# EAGLE design Puzzle_Controller (EAGLE 9.6.2)
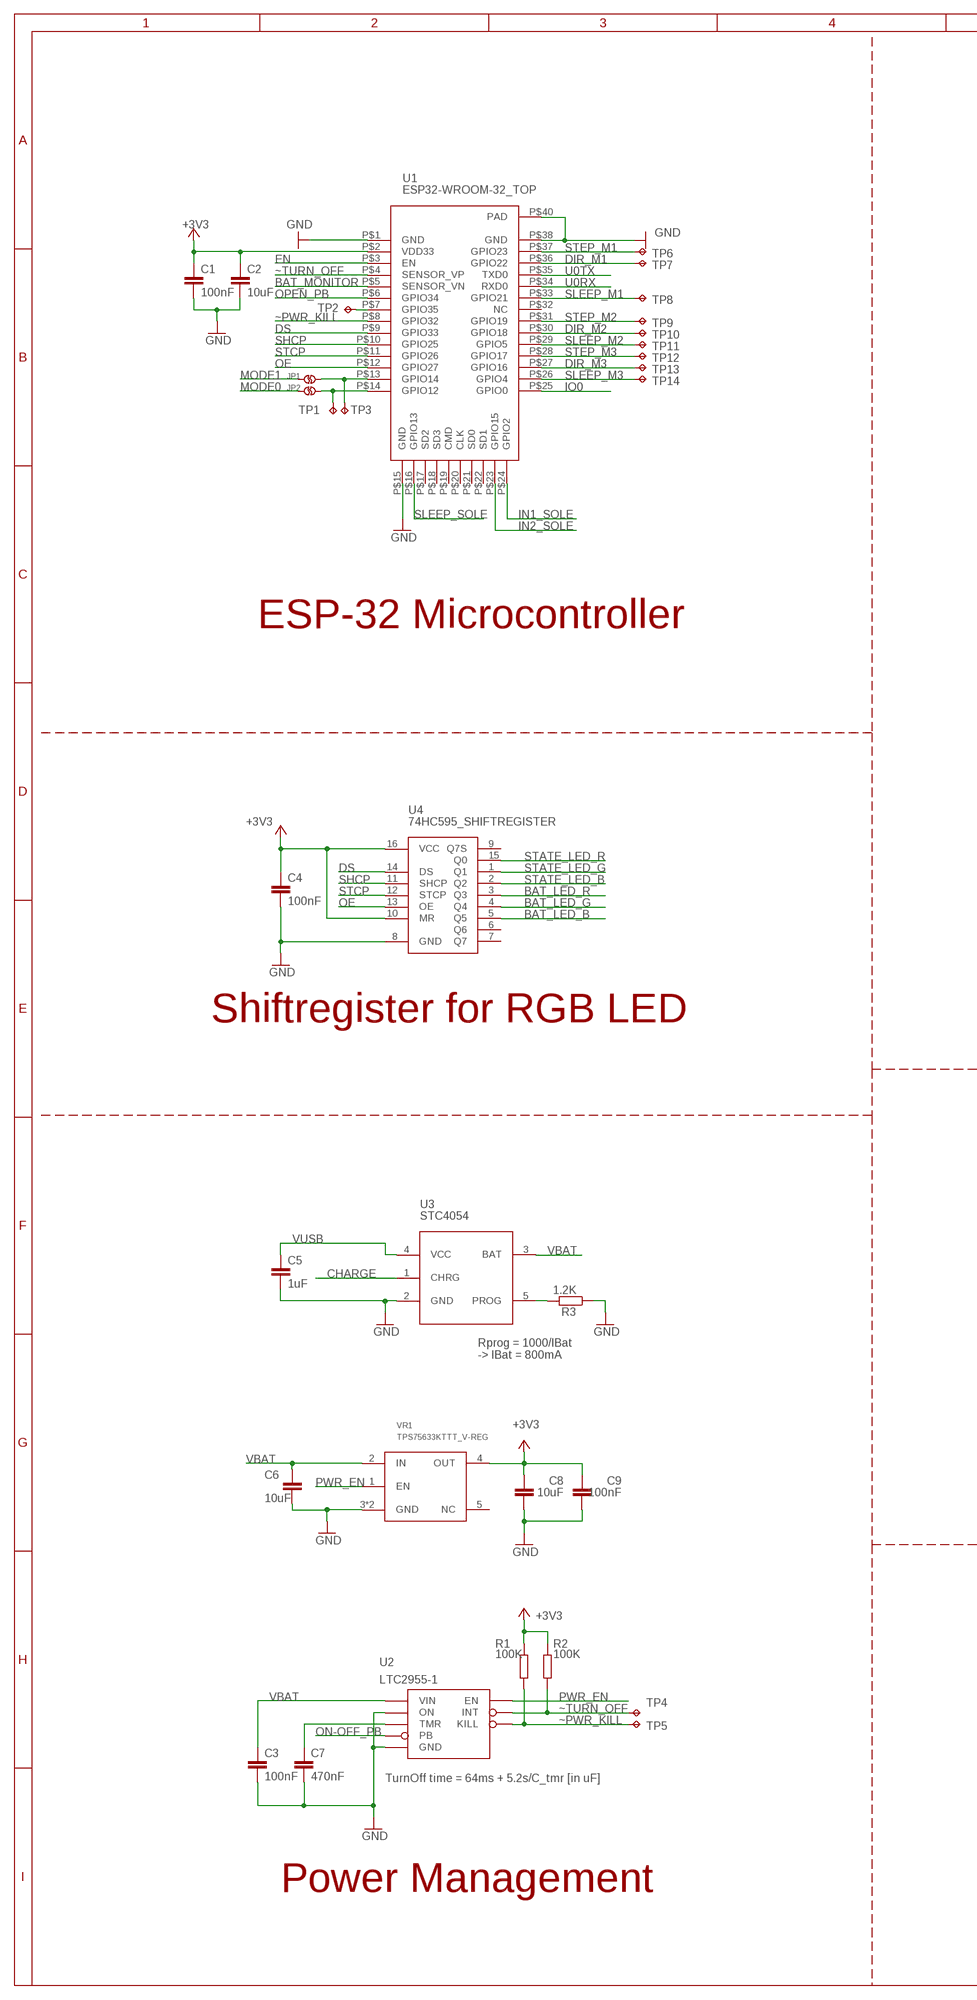
[diagram p0: schematic, sheet 1, part 1 of 2]
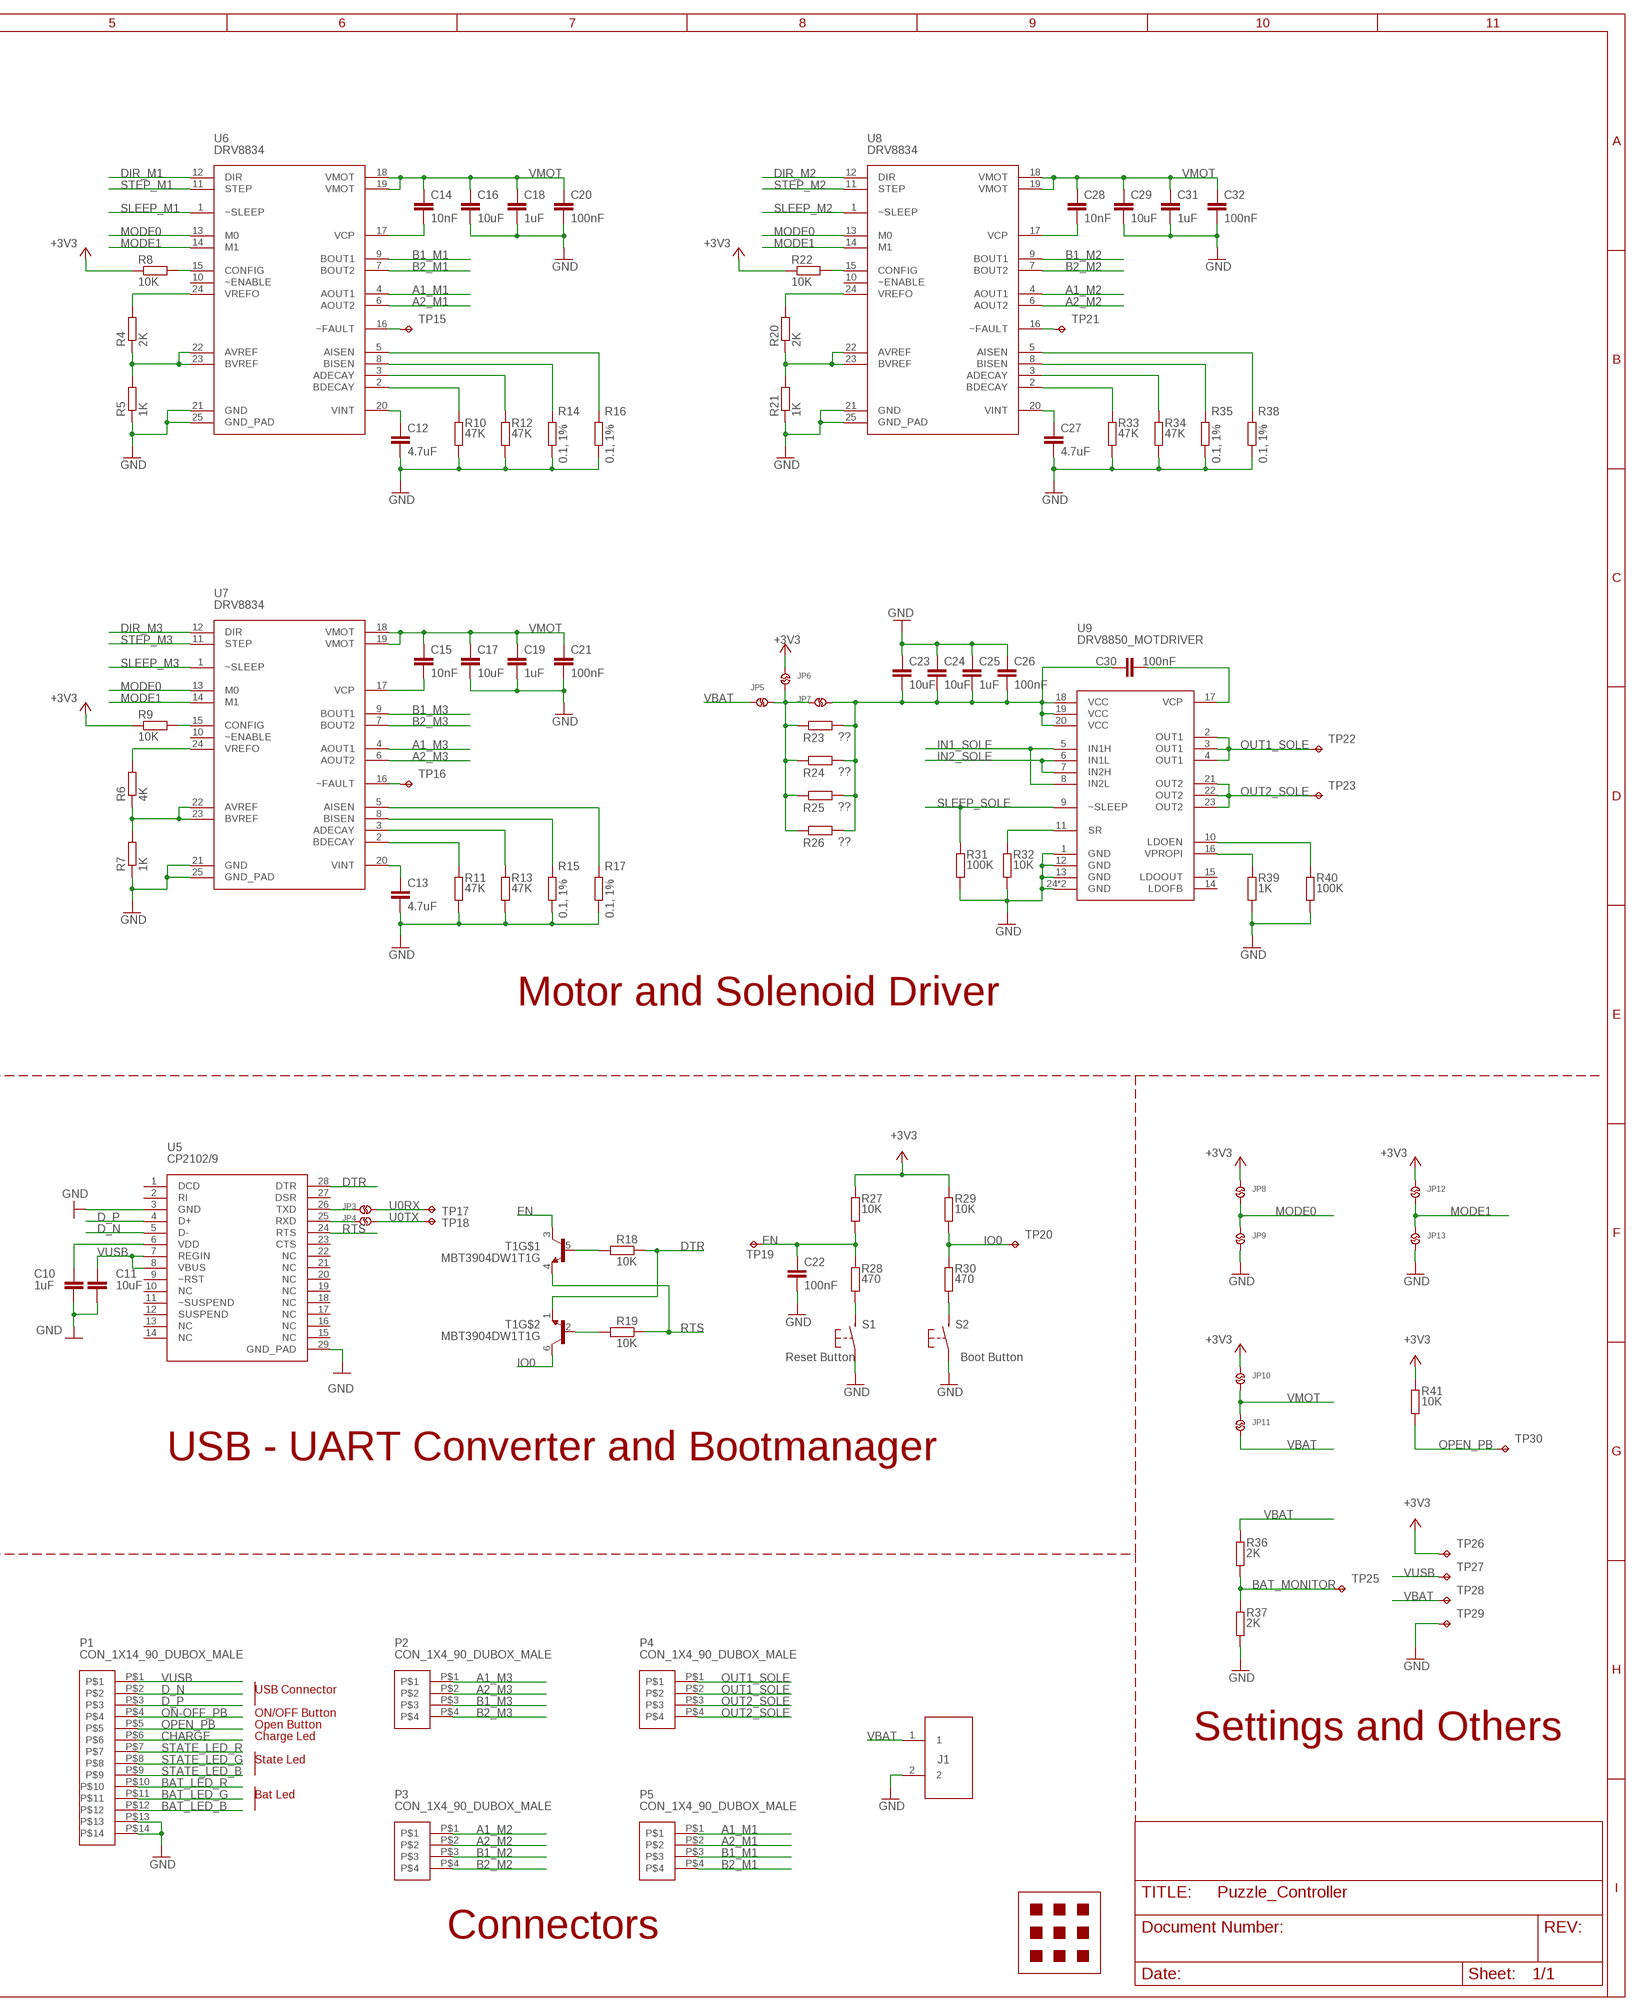
[diagram p1: schematic, sheet 1, part 2 of 2]

## Parts
C1  100nF  CAP_0603  [0603]
C2  10uF  CAP_0603  [0603]
C3  100nF  CAP_0603  [0603]
C4  100nF  CAP_0603  [0603]
C5  1uF  CAP_0603  [0603]
C6  10uF  CAP_0603  [0603]
C7  470nF  CAP_0603  [0603]
C8  10uF  CAP_0603  [0603]
C9  100nF  CAP_0603  [0603]
C10  1uF  CAP_0603  [0603]
C11  10uF  CAP_0603  [0603]
C12  4.7uF  CAP_0603  [0603]
C13  4.7uF  CAP_0603  [0603]
C14  10nF  CAP_0603  [0603]
C15  10nF  CAP_0603  [0603]
C16  10uF  CAP_0603  [0603]
C17  10uF  CAP_0603  [0603]
C18  1uF  CAP_0603  [0603]
C19  1uF  CAP_0603  [0603]
C20  100nF  CAP_0603  [0603]
C21  100nF  CAP_0603  [0603]
C22  100nF  CAP_0603  [0603]
C23  10uF  CAP_0603  [0603]
C24  10uF  CAP_0603  [0603]
C25  1uF  CAP_0603  [0603]
C26  100nF  CAP_0603  [0603]
C27  4.7uF  CAP_0603  [0603]
C28  10nF  CAP_0603  [0603]
C29  10uF  CAP_0603  [0603]
C30  100nF  CAP_0603  [0603]
C31  1uF  CAP_0603  [0603]
C32  100nF  CAP_0603  [0603]
J1  CON_2  [CON_2]
JP1  SOLDER_JUMPER  [SOLDER_JUMPER]
JP2  SOLDER_JUMPER  [SOLDER_JUMPER]
JP3  SOLDER_JUMPER  [SOLDER_JUMPER]
JP4  SOLDER_JUMPER  [SOLDER_JUMPER]
JP5  SOLDER_JUMPER  [SOLDER_JUMPER]
JP6  SOLDER_JUMPER  [SOLDER_JUMPER]
JP7  SOLDER_JUMPER  [SOLDER_JUMPER]
JP8  SOLDER_JUMPER  [SOLDER_JUMPER]
JP9  SOLDER_JUMPER  [SOLDER_JUMPER]
JP10  SOLDER_JUMPER  [SOLDER_JUMPER]
JP11  SOLDER_JUMPER  [SOLDER_JUMPER]
JP12  SOLDER_JUMPER  [SOLDER_JUMPER]
JP13  SOLDER_JUMPER  [SOLDER_JUMPER]
MEC1  FREESTYLE_PAD  [FREESTYLE_PAD]
P1  CON_1X14_90_DUBOX_MALE  [CON_1X14_90_DUBOX_MALE]
P2  CON_1X4_90_DUBOX_MALE  [CON_1X4_90_DUBOX_MALE]
P3  CON_1X4_90_DUBOX_MALE  [CON_1X4_90_DUBOX_MALE]
P4  CON_1X4_90_DUBOX_MALE  [CON_1X4_90_DUBOX_MALE]
P5  CON_1X4_90_DUBOX_MALE  [CON_1X4_90_DUBOX_MALE]
R1  100K  RES_0603  [0603]
R2  100K  RES_0603  [0603]
R3  1.2K  RES_0603  [0603]
R4  2K  RES_0603  [0603]
R5  1K  RES_0603  [0603]
R6  4K  RES_0603  [0603]
R7  1K  RES_0603  [0603]
R8  10K  RES_0603  [0603]
R9  10K  RES_0603  [0603]
R10  47K  RES_0603  [0603]
R11  47K  RES_0603  [0603]
R12  47K  RES_0603  [0603]
R13  47K  RES_0603  [0603]
R14  0.1, 1%  RES_0603  [0603]
R15  0.1, 1%  RES_0603  [0603]
R16  0.1, 1%  RES_0603  [0603]
R17  0.1, 1%  RES_0603  [0603]
R18  10K  RES_0603  [0603]
R19  10K  RES_0603  [0603]
R20  2K  RES_0603  [0603]
R21  1K  RES_0603  [0603]
R22  10K  RES_0603  [0603]
R23  ??  RES_0603  [0603]
R24  ??  RES_0603  [0603]
R25  ??  RES_0603  [0603]
R26  ??  RES_0603  [0603]
R27  10K  RES_0603  [0603]
R28  470  RES_0603  [0603]
R29  10K  RES_0603  [0603]
R30  470  RES_0603  [0603]
R31  100K  RES_0603  [0603]
R32  10K  RES_0603  [0603]
R33  47K  RES_0603  [0603]
R34  47K  RES_0603  [0603]
R35  0.1, 1%  RES_0603  [0603]
R36  2K  RES_0603  [0603]
R37  2K  RES_0603  [0603]
R38  0.1, 1%  RES_0603  [0603]
R39  1K  RES_0603  [0603]
R40  100K  RES_0603  [0603]
R41  10K  RES_0603  [0603]
S1  B3U-1000P  BUTTON_B3U-1000P  [B3U-1000P]
S2  B3U-1000P  BUTTON_B3U-1000P  [B3U-1000P]
T1  MBT3904DW1T1G  [SOT23-6]
TP1  TP  [TEST_PAD]
TP2  TP  [TEST_PAD]
TP3  TP  [TEST_PAD]
TP4  TP  [TEST_PAD]
TP5  TP  [TEST_PAD]
TP6  TP  [TEST_PAD]
TP7  TP  [TEST_PAD]
TP8  TP  [TEST_PAD]
TP9  TP  [TEST_PAD]
TP10  TP  [TEST_PAD]
TP11  TP  [TEST_PAD]
TP12  TP  [TEST_PAD]
TP13  TP  [TEST_PAD]
TP14  TP  [TEST_PAD]
TP15  TP  [TEST_PAD]
TP16  TP  [TEST_PAD]
TP17  TP  [TEST_PAD]
TP18  TP  [TEST_PAD]
TP19  TP  [TEST_PAD]
TP20  TP  [TEST_PAD]
TP21  TP  [TEST_PAD]
TP22  TP  [TEST_PAD]
TP23  TP  [TEST_PAD]
TP25  TP  [TEST_PAD]
TP26  TP  [TEST_PAD]
TP27  TP  [TEST_PAD]
TP28  TP  [TEST_PAD]
TP29  TP  [TEST_PAD]
TP30  TP  [TEST_PAD]
U1  ESP32-WROOM-32_TOP  [ESP32-WROOM-32_TOP]
U2  LTC2955-1  LTC2955-1_ON/OFF_CTLR  [SOT23-8]
U3  STC4054  STC4054_BAT_CHARGER  [TSOT23-5L]
U4  74HC595_SHIFTREGISTER  [SOIC-16]
U5  CP2102/9  [QFN-28]
U6  DRV8834  [TSSOP-24]
U7  DRV8834  [TSSOP-24]
U8  DRV8834  [TSSOP-24]
U9  DRV8850_MOTDRIVER  [QFN-24]
VR1  TPS75633KTTT_V-REG  [TPS75633KTTT_V-REG]

## Nets
+3V3: C1.1 C2.1 C4.1 C8.2 C9.2 JP6.P$2 JP8.P$1 JP10.P$1 JP12.P$1 R1.1 R2.1 R8.1 R9.1 R22.1 R27.2 R29.2 R41.2 TP26.TP U1.P$2(VDD33) U4.10(MR) U4.16(VCC) VR1.4(OUT)
A1_M1: P5.P$1 U6.4(AOUT1)
A1_M2: P3.P$1 U8.4(AOUT1)
A1_M3: P2.P$1 U7.4(AOUT1)
A2_M1: P5.P$2 U6.6(AOUT2)
A2_M2: P3.P$2 U8.6(AOUT2)
A2_M3: P2.P$2 U7.6(AOUT2)
B1_M1: P5.P$3 U6.9(BOUT1)
B1_M2: P3.P$3 U8.9(BOUT1)
B1_M3: P2.P$3 U7.9(BOUT1)
B2_M1: P5.P$4 U6.7(BOUT2)
B2_M2: P3.P$4 U8.7(BOUT2)
B2_M3: P2.P$4 U7.7(BOUT2)
BAT_LED_B: P1.P$12 U4.5(Q5)
BAT_LED_G: P1.P$11 U4.4(Q4)
BAT_LED_R: P1.P$10 U4.3(Q3)
BAT_MONITOR: R36.2 R37.1 TP25.TP U1.P$5(SENSOR_VN)
CHARGE: P1.P$6 U3.1(CHRG)
D_N: P1.P$2 U5.5(D-)
D_P: P1.P$3 U5.4(D+)
DIR_M1: TP7.TP U1.P$36(GPIO22) U6.12(DIR)
DIR_M2: TP10.TP U1.P$30(GPIO18) U8.12(DIR)
DIR_M3: TP13.TP U1.P$27(GPIO16) U7.12(DIR)
DS: U1.P$9(GPIO33) U4.14(DS)
DTR: R18.1 T1.1(E) U5.28(DTR)
EN: C22.1 R27.1 R28.2 T1.3(C) TP19.TP U1.P$3(EN)
GND: C1.2 C2.2 C3.2 C4.2 C5.2 C6.2 C7.2 C8.1 C9.1 C10.2 C11.2 C12.2 C13.2 C16.2 C17.2 C18.2 C19.2 C20.2 C21.2 C22.2 C23.1 C24.1 C25.1 C26.1 C27.2 C29.2 C31.2 C32.2 J1.2 JP9.P$2 JP13.P$2 P1.P$13 P1.P$14 R3.1 R5.1 R7.1 R10.1 R11.1 R12.1 R13.1 R14.1 R15.1 R16.1 R17.1 R21.1 R31.1 R32.1 R33.1 R34.1 R35.1 R37.2 R38.1 R39.1 R40.1 S1.P$1(P) S2.P$1(P) TP29.TP U1.P$1(GND) U1.P$15(GND) U1.P$38(GND) U1.P$40(PAD) U2.1(ON) U2.4(GND) U3.2(GND) U4.8(GND) U5.3(GND) U5.29(GND_PAD) U6.21(GND) U6.25(GND_PAD) U7.21(GND) U7.25(GND_PAD) U8.21(GND) U8.25(GND_PAD) U9.1(GND) U9.12(GND) U9.13(GND) U9.24(GND) U9.25(GND) VR1.3(GND) VR1.6(GND)
IN1_SOLE: U1.P$24(GPIO2) U9.5(IN1H) U9.8(IN2L)
IN2_SOLE: U1.P$23(GPIO15) U9.6(IN1L) U9.7(IN2H)
IO0: R29.1 R30.2 T1.6(C) TP20.TP U1.P$25(GPIO0)
MODE0: JP2.P$1 JP8.P$2 JP9.P$1 U6.13(M0) U7.13(M0) U8.13(M0)
MODE1: JP1.P$1 JP12.P$2 JP13.P$1 U6.14(M1) U7.14(M1) U8.14(M1)
N$1: R28.1 S1.P$2(S)
N$2: R8.2 U6.15(CONFIG)
N$3: R30.1 S2.P$2(S)
N$4: R18.2 T1.5(B)
N$5: R19.2 T1.2(B)
N$6: C10.1 U5.6(VDD)
N$7: R4.1 R5.2 U6.22(AVREF) U6.23(BVREF)
N$8: R4.2 U6.24(VREFO)
N$9: C14.2 U6.17(VCP)
N$10: C12.1 U6.20(VINT)
N$11: JP3.P$1 U5.26(TXD)
N$12: R10.2 U6.2(BDECAY)
N$13: R12.2 U6.3(ADECAY)
N$14: R14.2 U6.8(BISEN)
N$15: R16.2 U6.5(AISEN)
N$16: JP5.P$1 JP6.P$1 JP7.P$1 R23.1 R24.1 R25.1 R26.1
N$17: TP15.TP U6.16(~FAULT)
N$18: JP4.P$1 U5.25(RXD)
N$19: R3.2 U3.5(PROG)
N$20: TP2.TP U1.P$7(GPIO35)
N$21: R22.2 U8.15(CONFIG)
N$23: C23.2 C24.2 C25.2 C26.2 C30.1 JP7.P$2 R23.2 R24.2 R25.2 R26.2 U9.18(VCC) U9.19(VCC) U9.20(VCC)
N$24: JP1.P$2 TP3.TP U1.P$13(GPIO14)
N$25: C7.1 U2.3(TMR)
N$27: R20.1 R21.2 U8.22(AVREF) U8.23(BVREF)
N$28: R20.2 U8.24(VREFO)
N$29: C28.2 U8.17(VCP)
N$31: TP21.TP U8.16(~FAULT)
N$32: C27.1 U8.20(VINT)
N$33: R33.2 U8.2(BDECAY)
N$34: R34.2 U8.3(ADECAY)
N$35: R35.2 U8.8(BISEN)
N$37: R38.2 U8.5(AISEN)
N$38: R9.2 U7.15(CONFIG)
N$39: R6.1 R7.2 U7.22(AVREF) U7.23(BVREF)
N$40: R6.2 U7.24(VREFO)
N$41: C15.2 U7.17(VCP)
N$42: TP16.TP U7.16(~FAULT)
N$43: C13.1 U7.20(VINT)
N$44: R11.2 U7.2(BDECAY)
N$45: R13.2 U7.3(ADECAY)
N$46: R15.2 U7.8(BISEN)
N$47: R17.2 U7.5(AISEN)
N$48: R39.2 U9.16(VPROPI)
N$49: R32.2 U9.11(SR)
N$50: C30.2 U9.17(VCP)
N$52: R40.2 U9.10(LDOEN)
N$53: JP2.P$2 TP1.TP U1.P$14(GPIO12)
OE: U1.P$12(GPIO27) U4.13(OE)
ON-OFF_PB: P1.P$4 U2.5(PB)
OPEN_PB: P1.P$5 R41.1 TP30.TP U1.P$6(GPIO34)
OUT1_SOLE: P4.P$1 P4.P$2 TP22.TP U9.2(OUT1) U9.3(OUT1) U9.4(OUT1)
OUT2_SOLE: P4.P$3 P4.P$4 TP23.TP U9.21(OUT2) U9.22(OUT2) U9.23(OUT2)
PWR_EN: U2.7(EN) VR1.1(EN)
RTS: R19.1 T1.4(E) U5.24(RTS)
SHCP: U1.P$10(GPIO25) U4.11(SHCP)
SLEEP_M1: TP8.TP U1.P$33(GPIO21) U6.1(~SLEEP)
SLEEP_M2: TP11.TP U1.P$29(GPIO5) U8.1(~SLEEP)
SLEEP_M3: TP14.TP U1.P$26(GPIO4) U7.1(~SLEEP)
SLEEP_SOLE: R31.2 U1.P$16(GPIO13) U9.9(~SLEEP)
STATE_LED_B: P1.P$9 U4.2(Q2)
STATE_LED_G: P1.P$8 U4.1(Q1)
STATE_LED_R: P1.P$7 U4.15(Q0)
STCP: U1.P$11(GPIO26) U4.12(STCP)
STEP_M1: TP6.TP U1.P$37(GPIO23) U6.11(STEP)
STEP_M2: TP9.TP U1.P$31(GPIO19) U8.11(STEP)
STEP_M3: TP12.TP U1.P$28(GPIO17) U7.11(STEP)
U0RX: JP3.P$2 TP17.TP U1.P$34(RXD0)
U0TX: JP4.P$2 TP18.TP U1.P$35(TXD0)
VBAT: C3.1 C6.1 J1.1 JP5.P$2 JP11.P$2 R36.1 TP28.TP U2.6(VIN) U3.3(BAT) VR1.2(IN)
VMOT: C14.1 C15.1 C16.1 C17.1 C18.1 C19.1 C20.1 C21.1 C28.1 C29.1 C31.1 C32.1 JP10.P$2 JP11.P$1 U6.18(VMOT) U6.19(VMOT) U7.18(VMOT) U7.19(VMOT) U8.18(VMOT) U8.19(VMOT)
VUSB: C5.1 C11.1 P1.P$1 TP27.TP U3.4(VCC) U5.7(REGIN) U5.8(VBUS)
~PWR_KILL: R1.2 TP5.TP U1.P$8(GPIO32) U2.2(KILL)
~TURN_OFF: R2.2 TP4.TP U1.P$4(SENSOR_VP) U2.8(INT)
Unconnected: U1.P$17(SD2) U1.P$18(SD3) U1.P$19(CMD) U1.P$20(CLK) U1.P$21(SD0) U1.P$22(SD1) U1.P$32(NC) U4.6(Q6) U4.7(Q7) U4.9(Q7S) U5.1(DCD) U5.2(RI) U5.9(~RST) U5.10(NC) U5.11(~SUSPEND) U5.12(SUSPEND) U5.13(NC) U5.14(NC) U5.15(NC) U5.16(NC) U5.17(NC) U5.18(NC) U5.19(NC) U5.20(NC) U5.21(NC) U5.22(NC) U5.23(CTS) U5.27(DSR) U6.10(~ENABLE) U7.10(~ENABLE) U8.10(~ENABLE) U9.14(LDOFB) U9.15(LDOOUT) VR1.5(NC)

## Notes on the sheet
- ESP-32 Microcontroller
- Motor and Solenoid Driver
- Shiftregister for RGB LED
- Reset Button | Boot Button
- Rprog = 1000/IBat 
  -> IBat = 800mA
- USB - UART Converter and Bootmanager
- USB Connector
- ON/OFF Button
- Open Button
- Charge Led | Settings and Others
- State Led
- TurnOff time = 64ms + 5.2s/C_tmr [in uF]
- Bat Led
- Power Management
- Connectors

## Library data of the parts
C1-C32 = ZHAW_BA:CAP_0603: Cap, 0603, Keramik, X7R, +-10%
J1 = ZHAW_BA:CON_2: 2 Pin Solder Pad
JP1-JP13 = ZHAW_BA:SOLDER_JUMPER
MEC1 = ZHAW_BA:FREESTYLE_PAD: Pads 6x6 3mm Raster für spätere Änderungen
P1 = ZHAW_BA:CON_1X14_90_DUBOX_MALE: Dubox, 1x14Pin, 2.54 Raster DigiKey: Pt.Nr: 609-1290-ND https://www.digikey.ch/product-detail/de/amphenol-icc-fci/76382-314LF/609-1290-ND/1001604 NOTE: Gegenstück: 65240-014LF
P2-P5 = ZHAW_BA:CON_1X4_90_DUBOX_MALE: Dubox 1x4P, 90°, 2.54mm Raster Distrelec: Pt.Nr: Distrelec Bestellnummer LINK DigiKey: Pt.Nr: 609-1293-ND https://www.digikey.ch/product-detail/de/amphenol-icc-fci/76382-404LF/609-1293-ND/1001607 Gegenstück: 609-1264-ND
R1-R41 = ZHAW_BA:RES_0603: Resistor, 0603, 0.1 W, +-1%
S1 S2 = ZHAW_BA:BUTTON_B3U-1000P: SMD Button, 3 x 2.5 x 1.6 mm, 12V Distrelec: Pt.Nr: SW1020CT-ND https://www.digikey.ch/product-detail/de/omron-electronics-inc-emc-div/B3U-1000P/SW1020CT-ND/1534357 DigiKey: Pt.Nr: 135-59-010 https://www.distrelec.ch/de/subminiatur-tastschalter-b3u-schliesser-5n-5mm-omron-electronic-components-b3u-1000p/p/13559010?track=true&no-cache=true&marketingPopup=false
T1 = ZHAW_BA:MBT3904DW1T1G: Beschreibung Zweifacher NPN Transistor, 200mA, 40V DigiKey: Pt.Nr: MBT3904DW1T1GOSCT-ND https://www.digikey.ch/product-detail/de/on-semiconductor/MBT3904DW1T1G/MBT3904DW1T1GOSCT-ND/918012
TP1-TP23 TP25-TP30 = ZHAW_BA:TP
U1 = ZHAW_BA:ESP32-WROOM-32_TOP: ESP32 Mikrokontroller Distrelec: Pt.Nr: 301-29-219 https://www.distrelec.ch/de/esp32-wlan-bt-ble-mcu-modul-adafruit-3320/p/30129219?track=true&no-cache=true&marketingPopup=false DigiKey: Pt.Nr: 1528-1801-ND https://www.digikey.ch/product-detail/de/adafruit-industries-llc/3320/1528-1801-ND/6560941
U2 = ZHAW_BA:LTC2955-1_ON/OFF_CTLR: On/OFF Controller, PUSHBUTT TSOT23-8 DigiKey: Pt.Nr: LTC2955CTS8-1#TRMPBFCT-ND https://www.digikey.ch/products/de?keywords=LTC2955CTS8-1%23TRMPBFCT-ND
U3 = ZHAW_BA:STC4054_BAT_CHARGER: STC4054GR IC BATT CHG LI-ION 1CEL TSOT23-5, 800mA DigiKey: Pt.Nr: 497-5809-1-ND https://www.digikey.ch/product-detail/de/stmicroelectronics/STC4054GR/497-5809-1-ND/1506465
U4 = ZHAW_BA:74HC595_SHIFTREGISTER: Shiftregister 74HC595D-Q100,118, 8Bit DigiKey: Pt.Nr: 1727-1011-1-ND https://www.digikey.ch/product-detail/de/nexperia-usa-inc/74HC595D-Q100-118/1727-1011-1-ND/3749018
U5 = ZHAW_BA:CP2102/9: Schnittstellen - Controller, USB-TO-UART BRIDGE 28VQFN DigiKey: Pt.Nr: 336-1160-1-ND https://www.digikey.ch/products/de/integrated-circuits-ics/interface-controllers/753?k=CP2102&k=&pkeyword=CP2102&sv=0&pv7=2&sf=0&FV=-8%7C753&quantity=&ColumnSort=0&page=1&stock=1&pageSize=25
U6-U8 = ZHAW_BA:DRV8834: DRV8834, Steppermotordriver, 1/32 Step, 1.5A DigiKey: Pt.Nr: 296-30428-5-ND https://www.digikey.ch/products/de/integrated-circuits-ics/pmic-motor-drivers-controllers/744?k=drv8834&k=&pkeyword=drv8834&sv=0&pv7=1&pv7=2&pv7=6&sf=0&FV=-8%7C744&quantity=&ColumnSort=0&page=1&stock=1&pageSize=25
U9 = ZHAW_BA:DRV8850_MOTDRIVER: Motordriver, 2-5.5V, 5A 24QFN DigiKey: Pt.Nr: 296-DRV8850RGYTCT-ND https://www.digikey.ch/product-detail/de/texas-instruments/DRV8850RGYT/296-DRV8850RGYTCT-ND/10665656
VR1 = ZHAW_BA:TPS75633KTTT_V-REG: Voltage Regulator, Linear, 3.3Vm 5A, DDPAK-5 DigiKey: Pt.Nr: 296-15919-1-ND https://www.digikey.ch/product-detail/de/texas-instruments/TPS75633KTTT/296-15919-1-ND/606353

## Board
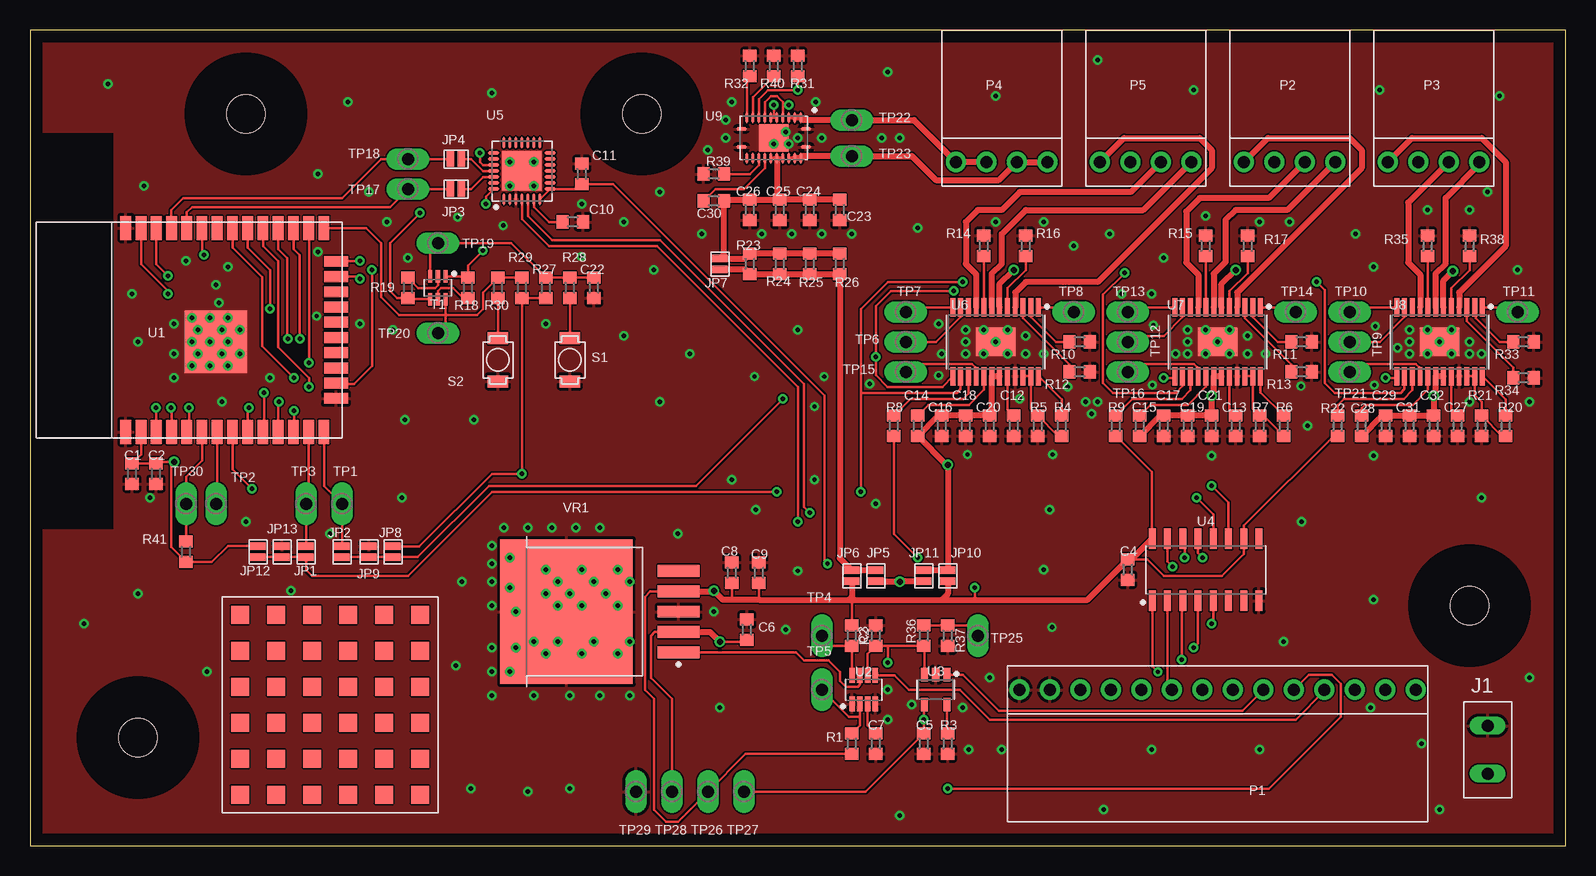
[diagram p2: board, top side]
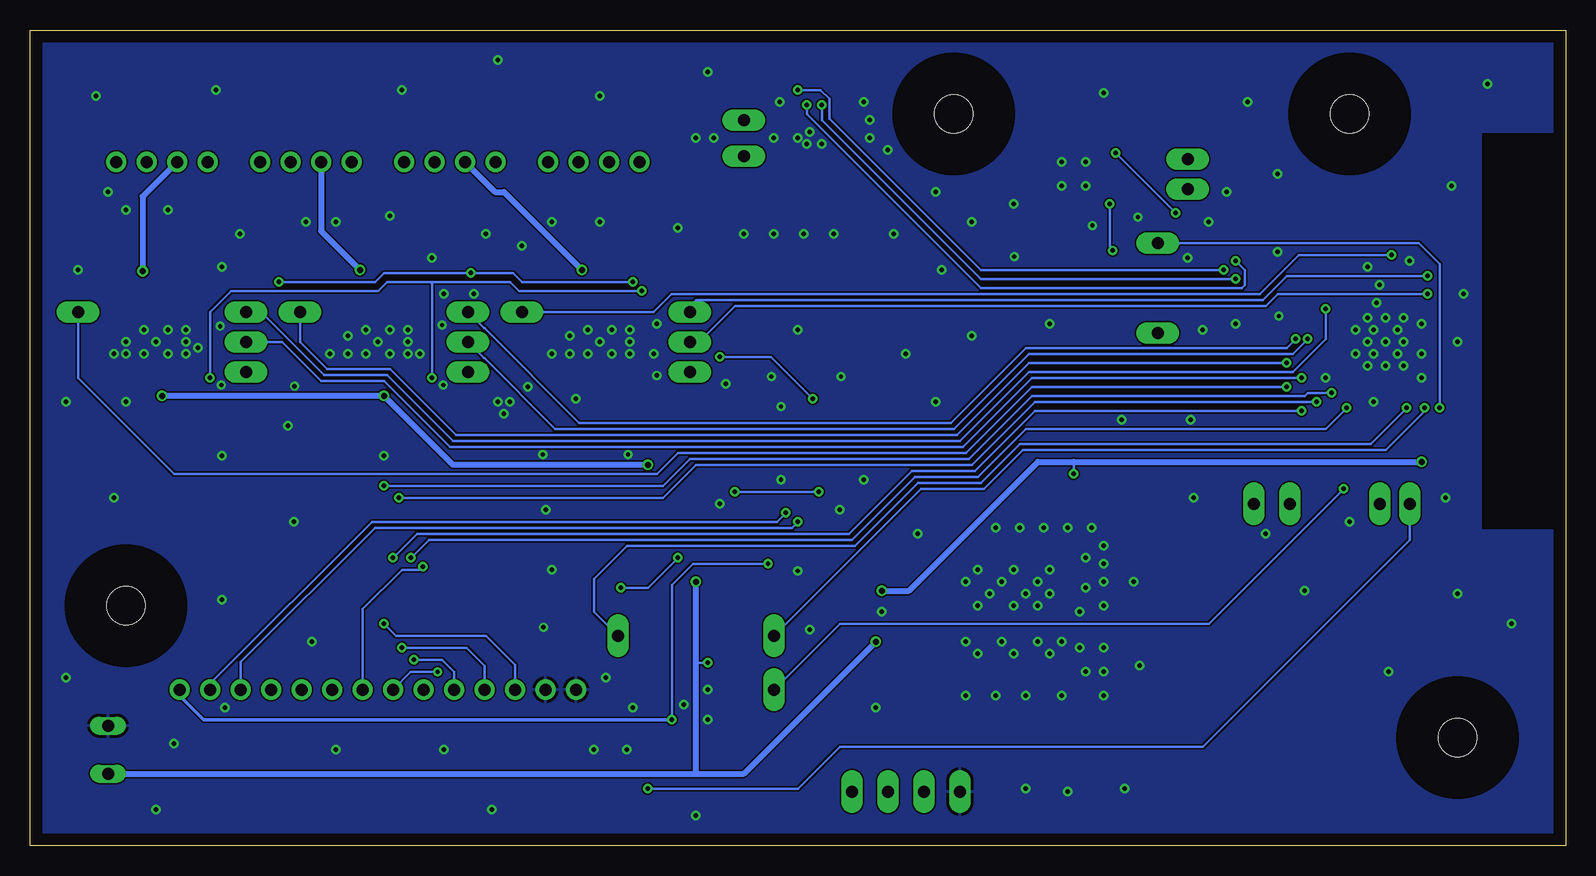
[diagram p3: board, bottom side, seen from below]

Size 128 x 68 mm. Coordinates in mm from the lower left corner, seen from the top.
Outline: 0,0 128,0 128,68 0,68 0,0
Copper layers (1*16): Top 0.035mm / dielectric 1.5mm / Bottom 0.035mm
Design rules "default *": minimum track width 6mil, minimum drill 0.35mm, track to track 5mil, track to pad 6mil, pad to pad 4mil, via to via 6mil, smd to smd 4mil, copper to edge 40mil, drill to drill 6mil, minimum pad ring 10mil, minimum via ring 8mil, stop-mask expansion 4mil, vias tented up to drill 20mil, thermal gap 10mil
Holes 3.2 mm at 9,9 18,61 120,20 51,61
tRestrict: area 115,15 to 125,25; area 4,4 to 14,14; area 13,56 to 23,66; area 46,56 to 56,66
bRestrict: area 13,56 to 23,66; area 46,56 to 56,66; area 115,15 to 125,25; area 4,4 to 14,14

### Footprints (pad centres in the part's own frame; a part is rotated, then mirrored left to right if it is on the bottom)
0603 = smd 1 x 1.1: 1 -0.85,0; 2 0.85,0
CON_2 = drill 1 long: 1 -2,0; 2 2,0
SOLDER_JUMPER = smd 0.635 x 1.27: P$1 -0.45,0; P$2 0.45,0
FREESTYLE_PAD = smd 1.5 x 1.5: P$1 1.5,1.5; P$2 4.5,1.5; P$3 7.5,1.5; P$4 10.5,1.5; P$5 13.5,1.5; P$6 1.5,4.5; P$7 4.5,4.5; P$8 7.5,4.5; P$9 10.5,4.5; P$10 13.5,4.5; P$11 1.5,7.5; P$12 4.5,7.5; P$13 7.5,7.5; P$14 10.5,7.5; P$15 13.5,7.5; P$16 1.5,10.5; P$17 4.5,10.5; P$18 7.5,10.5; P$19 10.5,10.5; P$20 13.5,10.5; P$21 1.5,13.5; P$22 4.5,13.5; P$23 7.5,13.5; P$24 10.5,13.5; P$25 13.5,13.5; P$26 16.5,1.5; P$27 16.5,4.5; P$28 16.5,7.5; P$29 16.5,10.5; P$30 16.5,13.5; P$31 16.5,16.5; P$32 13.5,16.5; P$33 10.5,16.5; P$34 7.5,16.5; P$35 4.5,16.5; P$36 1.5,16.5
CON_1X14_90_DUBOX_MALE = drill 1 pad 1.676: P$1 -16.51,0; P$2 -13.97,0; P$3 -11.43,0; P$4 -8.89,0; P$5 -6.35,0; P$6 -3.81,0; P$7 -1.27,0; P$8 1.27,0; P$9 3.81,0; P$10 6.35,0; P$11 8.89,0; P$12 11.43,0; P$13 13.97,0; P$14 16.51,0
CON_1X4_90_DUBOX_MALE = drill 1 pad 1.676: P$1 -3.81,0; P$2 -1.27,0; P$3 1.27,0; P$4 3.81,0
B3U-1000P = smd 1 x 1.7: P$1 -1.8,0; P$2 1.8,0
SOT23-6 = smd 1.02 x 0.36: 1 -0.955,0.65; 2 -0.955,0; 3 -0.955,-0.65; 4 0.955,-0.65; 5 0.955,0; 6 0.955,0.65
TEST_PAD = drill 1 pad 1.8 long: TP 0,0
ESP32-WROOM-32_TOP = smd 2 x 0.9: P$1 0.5,18.01; P$2 0.5,16.74; P$3 0.5,15.47; P$4 0.5,14.2; P$5 0.5,12.93; P$6 0.5,11.66; P$7 0.5,10.39; P$8 0.5,9.12; P$9 0.5,7.85; P$10 0.5,6.58; P$11 0.5,5.31; P$12 0.5,4.04; P$13 0.5,2.77; P$14 0.5,1.5; P$25 17.5,1.5; P$26 17.5,2.77; P$27 17.5,4.04; P$28 17.5,5.31; P$29 17.5,6.58; P$30 17.5,7.85; P$31 17.5,9.12; P$32 17.5,10.39; P$33 17.5,11.66; P$34 17.5,12.93; P$35 17.5,14.2; P$36 17.5,15.47; P$37 17.5,16.74; P$38 17.5,18.01 | smd 0.9 x 2: P$15 3.285,0.5; P$16 4.555,0.5; P$17 5.825,0.5; P$18 7.095,0.5; P$19 8.365,0.5; P$20 9.635,0.5; P$21 10.905,0.5; P$22 12.175,0.5; P$23 13.445,0.5; P$24 14.715,0.5 | smd 5.2 x 5.2: P$40 8,10.51
SOT23-8 = smd 1.237 x 0.459: 1 -1.187,0.975; 2 -1.187,0.325; 3 -1.187,-0.325; 4 -1.187,-0.975; 5 1.187,-0.975; 6 1.187,-0.325; 7 1.187,0.325; 8 1.187,0.975
TSOT23-5L = smd 1.119 x 0.589: 1 -1.246,0.95; 2 -1.246,0; 3 -1.246,-0.95; 4 1.246,-0.95; 5 1.246,0.95
SOIC-16 = smd 1.746 x 0.592: 1 -2.585,4.445; 2 -2.585,3.175; 3 -2.585,1.905; 4 -2.585,0.635; 5 -2.585,-0.635; 6 -2.585,-1.905; 7 -2.585,-3.175; 8 -2.585,-4.445; 9 2.585,-4.445; 10 2.585,-3.175; 11 2.585,-1.905; 12 2.585,-0.635; 13 2.585,0.635; 14 2.585,1.905; 15 2.585,3.175; 16 2.585,4.445
QFN-28 = smd 0.969 x 0.264: 1 -2.371,1.5; 2 -2.371,1; 3 -2.371,0.5; 4 -2.371,0; 5 -2.371,-0.5; 6 -2.371,-1; 7 -2.371,-1.5; 15 2.371,-1.5; 16 2.371,-1; 17 2.371,-0.5; 18 2.371,0; 19 2.371,0.5; 20 2.371,1; 21 2.371,1.5 | smd 0.264 x 0.969: 8 -1.5,-2.371; 9 -1,-2.371; 10 -0.5,-2.371; 11 0,-2.371; 12 0.5,-2.371; 13 1,-2.371; 14 1.5,-2.371; 22 1.5,2.371; 23 1,2.371; 24 0.5,2.371; 25 0,2.371; 26 -0.5,2.371; 27 -1,2.371; 28 -1.5,2.371 | smd 3.3 x 3.3: 29 0,0
TSSOP-24 = smd 1.572 x 0.407: 1 -2.872,3.575; 2 -2.872,2.925; 3 -2.872,2.275; 4 -2.872,1.625; 5 -2.872,0.975; 6 -2.872,0.325; 7 -2.872,-0.325; 8 -2.872,-0.975; 9 -2.872,-1.625; 10 -2.872,-2.275; 11 -2.872,-2.925; 12 -2.872,-3.575; 13 2.872,-3.575; 14 2.872,-2.925; 15 2.872,-2.275; 16 2.872,-1.625; 17 2.872,-0.975; 18 2.872,-0.325; 19 2.872,0.325; 20 2.872,0.975; 21 2.872,1.625; 22 2.872,2.275; 23 2.872,2.925; 24 2.872,3.575 | smd 2.4 x 3.3: 25 0,0
QFN-24 = smd 0.896 x 0.27: 1 -2.687,-0.75; 12 2.687,-0.75; 13 2.687,0.75; 24 -2.687,0.75 | smd 0.27 x 0.896: 2 -2.25,-1.687; 3 -1.75,-1.687; 4 -1.25,-1.687; 5 -0.75,-1.687; 6 -0.25,-1.687; 7 0.25,-1.687; 8 0.75,-1.687; 9 1.25,-1.687; 10 1.75,-1.687; 11 2.25,-1.687; 14 2.25,1.687; 15 1.75,1.687; 16 1.25,1.687; 17 0.75,1.687; 18 0.25,1.687; 19 -0.25,1.687; 20 -0.75,1.687; 21 -1.25,1.687; 22 -1.75,1.687; 23 -2.25,1.687 | smd 2.44 x 2.26: 25 0,0
TPS75633KTTT_V-REG = smd 3.469 x 0.994: 1 -6.558,3.4; 2 -6.558,1.7; 3 -6.558,0; 4 -6.558,-1.7; 5 -6.558,-3.4 | smd 11.025 x 12.066: 6 2.78,0

### Placement (x,y rotation side)
C1  8.5,31 270 top
C2  10.5,31 270 top
C3  70.5,17.5 90 top
C4  91.5,23 270 top
C5  74.5,8.5 270 top
C6  59.75,18 90 top
C7  70.5,8.5 270 top
C8  58.5,22.75 270 top
C9  60.75,22.75 270 top
C10  45.25,52 0 top
C11  46,56 90 top
C12  82,35 270 top
C13  100.5,35 270 top
C14  74,35 90 top
C15  92.5,35 90 top
C16  76,35 270 top
C17  94.5,35 270 top
C18  78,35 270 top
C19  96.5,35 270 top
C20  80,35 270 top
C21  98.5,35 270 top
C22  47,46.5 270 top
C23  67.5,53 90 top
C24  65,53 90 top
C25  62.5,53 90 top
C26  60,53 90 top
C27  119,35 270 top
C28  111,35 90 top
C29  113,35 270 top
C30  57,53.75 180 top
C31  115,35 270 top
C32  117,35 270 top
J1  121.5,8 90 top
JP1  23,24.5 90 top
JP2  26,24.5 90 top
JP3  35.5,54.75 180 top
JP4  35.5,57.25 180 top
JP5  70.5,22.5 270 top
JP6  68.5,22.5 270 top
JP7  57.5,48.5 90 top
JP8  30.25,24.5 270 top
JP9  28.25,24.5 90 top
JP10  76.5,22.5 90 top
JP11  74.5,22.5 270 top
JP12  19,24.5 270 top
JP13  21,24.5 90 top
MEC1  16,2.75 0 top
P1  99,13 180 top
P2  105,57 0 top
P3  117,57 0 top
P4  81,57 0 top
P5  93,57 0 top
R1  68.5,8.5 90 top
R2  68.5,17.5 270 top
R3  76.5,8.5 90 top
R4  86,35 90 top
R5  84,35 90 top
R6  104.5,35 90 top
R7  102.5,35 90 top
R8  72,35 90 top
R9  90.5,35 90 top
R10  87.5,42 180 top
R11  106,42 180 top
R12  87.5,39.5 180 top
R13  106,39.5 180 top
R14  79.5,50 270 top
R15  98,50 270 top
R16  83,50 270 top
R17  101.5,50 270 top
R18  36.5,46.5 270 top
R19  31.5,46.5 90 top
R20  123,35 90 top
R21  121,35 90 top
R22  109,35 90 top
R23  60,48.5 90 top
R24  62.5,48.5 90 top
R25  65,48.5 90 top
R26  67.5,48.5 90 top
R27  43,46.5 270 top
R28  45,46.5 90 top
R29  41,46.5 270 top
R30  39,46.5 90 top
R31  64,65 270 top
R32  60,65 270 top
R33  124.5,42 180 top
R34  124.5,39 180 top
R35  116.5,50 270 top
R36  74.5,17.5 90 top
R37  76.5,17.5 270 top
R38  120,50 270 top
R39  57,56 0 top
R40  62,65 270 top
R41  13,24.5 270 top
S1  45,40.5 90 top
S2  39,40.5 90 top
T1  34,46.5 270 top
TP1  26,28.5 0 top
TP2  15.5,28.5 0 top
TP3  23,28.5 0 top
TP4  66,17.5 0 top
TP5  66,13 0 top
TP6  73,42 270 top
TP7  73,44.5 270 top
TP8  87,44.5 90 top
TP9  110,42 270 top
TP10  110,44.5 270 top
TP11  124,44.5 270 top
TP12  91.5,42 270 top
TP13  91.5,44.5 270 top
TP14  105.5,44.5 270 top
TP15  73,39.5 90 top
TP16  91.5,39.5 270 top
TP17  31.5,54.75 90 top
TP18  31.5,57.25 90 top
TP19  34,50.25 90 top
TP20  34,42.75 90 top
TP21  110,39.5 270 top
TP22  68.5,60.5 90 top
TP23  68.5,57.5 90 top
TP25  79,17.5 180 top
TP26  56.5,4.5 180 top
TP27  59.5,4.5 180 top
TP28  53.5,4.5 180 top
TP29  50.5,4.5 180 top
TP30  13,28.5 0 top
U1  26,34 90 top
U2  69.5,13 90 top
U3  75.5,13 270 top
U4  98,23 90 top
U5  41,56.25 90 top
U6  80.5,42 270 top
U7  99,42 270 top
U8  117.5,42 270 top
U9  62,59 180 top
VR1  47.5,19.5 180 top

### Tracks (layer width: path | path; a pad name or v marks a point on that pad's centre or on a via)
+3V3  (via drill 0.35, 0.5)
  Top 0.2: U4.16 93.5,25.64 93.5,31.15 R9.1 | C4.1 93.15,23.85 94.5,22.5 99.35,22.5 101.17,24.33 U4.10 101.17,26.68 108.75,34.25 108.9,34.25 R22.1 | C8.2 58.5,20.5 | C9.2 60.75,20.5 | R27.2 R29.2 v41,31 38.5,31 32.45,24.95 JP8.P$1 | U1.P$2 9.26,32.61 C1.1 C2.1 10.65,32 v12,32 11.75,31.75 11.75,24.9 R41.2 15.15,23.65 16.5,25 18.95,25 JP12.P$1 | R8.1 72,26 v74,24 | v78.75,21.5 78.75,20.5 | 68.25,20.5 68.5,20.25 R2.1 | VR1.4 51.7,21.2 51.25,20.75 51.25,13 52,12.25 52,3 53,2 54,2 TP26.TP 59.65,7.65 R1.1
  Top 0.5: JP6.P$2 68.5,20.75 68.25,20.5 | JP10.P$1 76.5,21 76,20.5 | 68.25,20.5 76,20.5 | 68.25,20.5 60.75,20.5 58.5,20.5 57.75,20.5 57.05,21.2 | 57.05,21.2 v57,21.25 | 76,20.5 78.75,20.5 88.15,20.5 C4.1 91.82,23.85 U4.16 | VR1.4 57.05,21.2
  Bottom 0.2: v74,24 76.5,21.5 v78.75,21.5 | v41,31 41,32
  Bottom 0.5: v57,21.25 54.75,21.25 44,32 41,32 v12,32
A1_M1
  Top 0.5: P5.P$1 91.19,59 97.5,59 98.5,58 98.5,56.5 89,47 83,47 82.12,46.12 U6.4
A1_M2
  Top 0.5: P3.P$1 115.19,59 121,59 123,57 123,50 119.12,46.12 U8.4
A1_M3
  Top 0.5: P2.P$1 103.19,59 110,59 111,58 111,56.5 100.62,46.12 U7.4
A2_M1  (via drill 0.5)
  Top 0.5: U6.6 80.83,46.83 v82,48
  Bottom 0.5: P5.P$2 89.23,54.5 88.5,54.5 v82,48
A2_M2  (via drill 0.5)
  Top 0.5: U8.6 117.83,47.12 v118.61,47.9
  Bottom 0.5: v118.61,47.9 118.61,54.12 P3.P$2
A2_M3  (via drill 0.5)
  Top 0.5: U7.6 99.33,46.83 v100.5,48
  Bottom 0.5: P2.P$2 103.73,51.23 v100.5,48
B1_M1
  Top 0.5: U6.9 78.88,47.62 78,48.5 78,52 79,53 81,53 82.5,54.5 91.77,54.5 P5.P$3
B1_M2
  Top 0.5: P3.P$3 114.88,53.6 114.88,48.62 115.88,47.62 U8.9
B1_M3
  Top 0.5: P2.P$3 103.27,54 97.5,54 96.38,52.88 96.38,48.62 97.38,47.62 U7.9
B2_M1
  Top 0.5: U6.7 80.17,47.67 81,48.5 81,51 83,53 92.81,53 P5.P$4
B2_M2
  Top 0.5: P3.P$4 120.81,56.81 118,54 118,48.5 117.17,47.67 U8.7
B2_M3
  Top 0.5: P2.P$4 104.81,53 100.5,53 99.67,52.17 99.67,48.67 98.67,47.67 U7.7
BAT_LED_B  (via drill 0.35)
  Top 0.2: v98.5,18.5 98.64,18.64 U4.5
  Bottom 0.2: P1.P$12 87.57,15.07 90,17.5 97.5,17.5 v98.5,18.5
BAT_LED_G  (via drill 0.35)
  Top 0.2: U4.4 97.36,16.86 v97,16.5
  Bottom 0.2: v97,16.5 91.61,16.5 90.11,15 P1.P$11
BAT_LED_R  (via drill 0.35)
  Top 0.2: U4.3 96,20.32 v96,15.5
  Bottom 0.2: v96,15.5 93.65,15.5 92.65,14.5 P1.P$10
BAT_MONITOR  (via drill 0.35)
  Top 0.2: TP25.TP 78.15,18.35 R37.1 R36.2 | v13.25,36.5 13.25,34.68 U1.P$5
  Bottom 0.2: TP25.TP 81,19.5 81,22.25 78.25,25 59.25,25 54,30.25 48.75,30.25 45.5,33.5 16.25,33.5 v13.25,36.5
CHARGE
  Top 0.2: P1.P$6 101.06,11.25 80.75,11.25 77.75,14.25 U3.1
D_N  (via drill 0.35)
  Top 0.2: U5.5 41.5,52.5 43.5,50.5 52.5,50.5 64.5,38.5 64.5,28.25 v65,27.75
  Bottom 0.2: P1.P$2 112.97,13.53 99.5,27 65.75,27 v65,27.75
D_P  (via drill 0.35)
  Top 0.2: v64,27 64,38.25 52.25,50 43.25,50 41,52.25 U5.4
  Bottom 0.2: P1.P$3 110.43,15.32 99.25,26.5 64.5,26.5 v64,27
DIR_M1  (via drill 0.35)
  Top 0.2: U6.12 73.42,44.87 73.05,44.5 TP7.TP | U1.P$36 10.53,48.47 v11.5,47.5
  Bottom 0.2: v11.5,47.5 23.25,47.5 25.25,45.5 72.5,45.5 73,45 TP7.TP
DIR_M2  (via drill 0.35)
  Top 0.2: TP10.TP 110.37,44.87 U8.12 | U1.P$30 18.15,49.85 20,48 v20,44.75
  Bottom 0.2: TP10.TP 108.75,44.5 103.5,39.25 98.25,39.25 92.75,33.75 50.5,33.75 44.75,39.5 22.75,39.5 20,42.25 v20,44.75
DIR_M3  (via drill 0.35)
  Top 0.2: U7.12 91.87,44.87 TP13.TP | v22.5,42.25 22.46,42.29 22.46,49.25 21.96,49.75 U1.P$27
  Bottom 0.2: TP13.TP 90.15,43.15 90.12,43.15 82.22,35.25 51.25,35.25 45,41.5 23.25,41.5 v22.5,42.25
DS  (via drill 0.35)
  Top 0.2: U4.14 96.25,25.43 v96.25,24 | v18.25,36.5 18.15,36.4 U1.P$9
  Bottom 0.2: v96.25,24 94.75,25.5 59.5,25.5 54.25,30.75 49,30.75 45,34.75 20,34.75 v18.25,36.5
DTR  (via drill 0.35)
  Top 0.2: T1.1 36.4,47.45 R18.1 36.5,48.37 v37.75,49.62 | v38,53.5 38,54.12 U5.28
  Bottom 0.2: v37.75,49.62 38,49.87 v38,53.5
EN  (via drill 0.35)
  Top 0.2: C22.1 R28.2 R27.1 40.1,50.25 TP19.TP 33.35,49.6 T1.3 | v10.5,36.5 10.53,36.47 U1.P$3
  Bottom 0.2: TP19.TP 12.25,50.25 10.5,48.5 v10.5,36.5
GND  (via drill 0.35)
  other vias: 31,29 25,26 18,27 21.75,21.25 9,21 9,42 16,37 20,39 40,57 42,55 42,57 40,55 64,43 55,41 52,48 56,51 61,51 63.5,51 66,51 68.5,51 56.5,58 70,38.5 76,41 84.5,41 83,42.5 78,43 78,42 78,41 83,41 80.5,42 79.5,43 81.5,43 81.5,41 79.5,41 99,42 100,43 96.5,43 96.5,42 96.5,41 95.5,41 98,43 98,41 100,41 101.5,42.5 101.5,41 103,41 38.5,25 38.5,23.5 38.5,22 38.5,20 38.5,16.5 38.5,14.5 42,12.5 38.5,12.5 45,12.5 47.5,12.5 50,12.5 47.5,26.5 45.5,26.5 43.5,26.5 41.5,26.5 39.5,26.5 54,26 63,18 57.5,11.5 57,19.5 117.5,42 116.5,43 118.5,43 116.5,41 118.5,41 115,43 115,42 115,41 114,41.5 120,42 120,41 121,41 120,37 125,37 88.5,36 106.5,35 98.5,32.5 112,32.5 89,37 88,37 84.5,23 85,28 106,27 121,29 112,20.5 104.5,17 80,14 93.5,8 102.5,8 81,8 89.5,3 72.5,2.5 12,39 12,41 12,43.5 9.5,55 30.25,43 43,43.5 49.5,42.5 63,59.5 66,59 72.5,59 62,58.5 65.5,62 80.5,62.5 112.5,63 97,63 122.5,62.5 110.5,51 94.5,49 87,50 74,51.5 70.5,28.5 60.5,28 58.5,30.5 71,59 124,48 52.5,37 26.5,62 6.5,63.5 117.5,3 116,8.5 125,14 46,53.5 49.5,52 116.5,53 120,53 121.5,54.5 98,52.5 102.5,52 105,52 80.5,52 84.5,52 71.5,10.5 71.5,13 73.5,11.75 78.25,8 77.75,11.5 111.75,11.5 38.5,62.75 93.5,46 91,46 75.75,43.5 63.25,58.5 10,29 31.25,35.5 37,35.5 23.9,44.15 27.5,43.5 31.5,49 24,49.5 13,48.75 16.5,48.25 15.5,46.75 15.75,45.25 29.75,52 28.25,54.5 52.5,54.5 90,51 112,48.25 14.75,14.5 36.75,4.75 45,4.75 86.5,38.25 82.5,37.25 78.15,32.6 85.25,32.6 45.95,49.1 39.45,51.7 35.65,52.4 105.95,38.3 112.05,38.4 112.15,43.3 93.65,43.4 93.55,38.4 75.75,39.2 85.2,18.2 60.4,39.1 66.2,39.1 65.4,36.6 65.4,30.5 64,22.9 49,16 46,16 43,16 43,23 46,23 49,23 44,17 47,17 50,17 44,22 47,22 50,22 48,21 45,21 43,21 46,20 49,20 44,20 42,17 13.5,40 15,40 16.5,40 17.5,41 16,41 14,41 16.5,42 15,42 13.5,42 14,43 16,43 17.5,43 16.5,44 15,44 13.5,44 8.5,46 24,56 71.5,64.5 89,65.5 36,22 35.5,15 40,24 40,21.5 40.5,19.5 40.5,16.5 40,14.5 4.5,18.5 41.5,4.5 64,59 58,59 58,60.5 58.5,62
  pour Top: -20,70 -20,-5 130,-5 130,70
  pour Bottom: -15,75 -15,-10 135,-10 135,75
IN1_SOLE  (via drill 0.35)
  Top 0.2: U9.5 62.75,61.75 | 62.75,61.75 62.75,62 62.25,62.5 61.75,62.5 61.25,62 U9.8 | 62.75,61.75 v63.25,61.75 | U1.P$24 25.54,48.75 v27.5,48.75
  Bottom 0.2: v63.25,61.75 63.25,61 48.75,46.5 27,46.5 26.75,46.75 26.75,48 v27.5,48.75
IN2_SOLE  (via drill 0.35)
  Top 0.2: U9.7 62,60.69 | 62,60.69 U9.6 | v62,61.75 62,60.69 | v27.5,47.25 27.3,47.45 U1.P$23
  Bottom 0.2: v62,61.75 62,60.5 48.75,47.25 v27.5,47.25
IO0
  Top 0.2: R29.1 R30.2 37.75,46.1 37.75,44.75 37.25,44.25 34.65,44.25 | TP20.TP 34.65,43.4 34.65,44.25 | T1.6 34.65,44.25 | 34.65,44.25 30.75,44.25 29.25,45.75 29.25,50.25 28,51.5 U1.P$25
MODE0  (via drill 0.35)
  Top 0.2: U7.13 95.3,39 v94.5,39 | U8.13 113.8,39 v113,39 | v77,46.25 71.75,46.25 70.5,45 v70.5,40.75 70.5,39.22 71.47,38.25 76.05,38.25 U6.13 | JP2.P$1 JP9.P$1 JP8.P$2 32.3,24.05 38.25,30 55.5,30 v62.75,37.25
  Bottom 0.2: v113,39 113,44.5 111.25,46.25 99,46.25 98.25,47 94.5,47 | v70.5,40.75 66.25,40.75 v62.75,37.25 | v77,46.25 87.25,46.25 88,47 94.5,47 | v94.5,39 94.5,47
MODE1  (via drill 0.35)
  Top 0.2: U6.14 77.58,38.08 77.25,37.75 69.25,37.75 | U7.14 96.08,38.33 95.5,37.75 90.25,37.75 89.45,38.55 89.45,45.95 v91.25,47.75 | U8.14 114.58,38.08 114.25,37.75 108.75,37.75 107.95,38.55 107.95,46.3 v107.25,47 | v77.75,47 71.5,47 69.25,44.75 69.25,37.75 | JP12.P$2 JP13.P$1 JP1.P$1 23,23 23.5,22.5 31.5,22.5 38.5,29.5 v62.25,29.5 | 69.25,37.75 v69.25,29.5
  Bottom 0.2: v69.25,29.5 v62.25,29.5 | v107.25,47 99.25,47 98.5,47.75 v91.25,47.75 87.75,47.75 87,47 v77.75,47
N$1
  Top 0.2: S1.P$2 R28.1
N$2
  Top 0.2: R8.2 73.4,37.25 77.79,37.25 78.22,37.68 U6.15
N$3
  Top 0.2: S2.P$2 R30.1
N$4
  Top 0.2: R18.2 36.1,45.65 35.25,46.5 34.25,46.5 34,46.25 T1.5
N$5
  Top 0.2: R19.2 32.35,46.5 33.75,46.5 34,46.75 T1.2
N$6
  Top 0.2: U5.6 42,53.25 43.25,52 C10.1
N$7
  Top 0.2: U6.22 U6.23 83.42,36.42 R5.2 85.7,34.15 R4.1
N$8
  Top 0.2: U6.24 86,37.2 R4.2
N$9
  Top 0.2: U6.17 79.53,38.02 78.25,36.75 74.9,36.75 C14.2
N$10
  Top 0.2: U6.20 81.47,36.38 C12.1
N$11
  Top 0.2: U5.26 37.75,55.75 36.75,54.75 JP3.P$1
N$12
  Top 0.2: U6.2 83.42,44.08 85.5,42 R10.2
N$13
  Top 0.2: U6.3 82.78,43.98 86.65,40.1 R12.2
N$14
  Top 0.2: U6.8 79.53,49.12 R14.2
N$15
  Top 0.2: R16.2 83,48 81.47,46.48 U6.5
N$16
  Top 0.5: JP5.P$1 JP6.P$1 67.5,23.95 R26.1 R25.1 R24.1 R23.1 59.6,48.05 JP7.P$1
N$17
  Top 0.2: U6.16 78.88,39.83 78.53,40.17 73.67,40.17 TP15.TP
N$18
  Top 0.2: JP4.P$1 36.75,57.25 37.75,56.25 U5.25
N$19
  Top 0.2: R3.2 76.45,9.4 U3.5
N$20
  Top 0.2: U1.P$7 15.61,28.61 TP2.TP
N$21
  Top 0.2: U8.15 115.22,37.98 114.5,37.25 109.5,37.25 109,36.75 R22.2
N$23
  Top 0.3: U9.18 U9.19 U9.20
  Top 0.5: C25.2 C26.2 57.95,53.85 C30.1 57.85,49.3 JP7.P$2 59.6,48.95 R23.2 R24.2 R25.2 R26.2 | U9.19 62.25,54.1 C25.2 | C23.2 C24.2 C25.2
N$24
  Top 0.2: TP3.TP 23.23,28.73 U1.P$13 | TP3.TP | TP3.TP JP1.P$2
N$25
  Top 0.2: U2.3 69.83,10.03 C7.1
N$27
  Top 0.2: U8.22 U8.23 120.42,37.58 121,37 R21.2 122.7,34.15 R20.1
N$28
  Top 0.2: R20.2 123,37.2 U8.24
N$29
  Top 0.2: C28.2 111,36.5 111.25,36.75 115.25,36.75 116.53,38.02 U8.17
N$31
  Top 0.2: U8.16 115.88,39.83 115.53,40.17 110.67,40.17 TP21.TP
N$32
  Top 0.2: C27.1 118.47,36.38 U8.20
N$33
  Top 0.2: U8.2 120.5,44.8 120.5,44 122.5,42 R33.2
N$34
  Top 0.2: U8.3 119.78,43.73 123.65,39.85 R34.2
N$35
  Top 0.2: U8.8 116.53,49.12 R35.2
N$37
  Top 0.2: R38.2 120,48 118.47,46.48 U8.5
N$38
  Top 0.2: U7.15 96.72,37.98 96,37.25 91.9,37.25 R9.2
N$39
  Top 0.2: U7.22 U7.23 101.92,36.42 R7.2 102.8,35.85 R6.1
N$40
  Top 0.2: R6.2 102.58,37.77 U7.24
N$41
  Top 0.2: C15.2 93.4,36.75 96.5,36.75 98.03,38.27 U7.17
N$42
  Top 0.2: U7.16 97.38,39.83 97.03,40.17 92.17,40.17 TP16.TP
N$43
  Top 0.2: C13.1 99.97,36.38 U7.20
N$44
  Top 0.2: U7.2 101.92,44.08 104,42 R11.2
N$45
  Top 0.2: U7.3 101.28,43.98 105.15,40.1 R13.2
N$46
  Top 0.2: R15.2 98.03,49.12 U7.8
N$47
  Top 0.2: R17.2 101.5,47.75 99.97,46.23 U7.5
N$48
  Top 0.2: U9.16 60.75,56.75 60,56 R39.2
N$49
  Top 0.2: R32.2 59.75,63.9 U9.11
N$50
  Top 0.2: C30.2 57.15,54.75 59.5,54.75 61.25,56.5 U9.17
N$52
  Top 0.2: R40.2 60.25,62.4 U9.10
N$53
  Top 0.2: U1.P$14 24.5,30 TP1.TP JP2.P$2
OE  (via drill 0.35)
  Top 0.2: U4.13 97.36,24.39 v97.75,24 | v22,36.25 22,34.54 U1.P$12
  Bottom 0.2: v97.75,24 95.75,26 59.75,26 54.5,31.25 49.25,31.25 44.25,36.25 v22,36.25
ON-OFF_PB
  Top 0.2: U2.5 72.06,14.19 73.25,13 77.5,13 80,10.5 105.5,10.5 107.89,12.89 P1.P$4
OPEN_PB  (via drill 0.35)
  Top 0.2: P1.P$5 106.6,14.25 108.5,14.25 109.25,13.5 109.25,10.75 103.25,4.75 v76.5,4.75 | R41.1 TP30.TP 13,30.75 14.34,32.09 U1.P$6
  Bottom 0.2: v76.5,4.75 64,4.75 60.5,8.25 30.25,8.25 13,25.5 TP30.TP
OUT1_SOLE
  Top 0.3: U9.3 U9.4
  Top 0.5: P4.P$2 P4.P$1 73.69,60.5 TP22.TP 64.44,60.5 U9.2 U9.3
OUT2_SOLE
  Top 0.3: U9.21 U9.22
  Top 0.5: P4.P$4 P4.P$3 80.77,55.5 75.5,55.5 73.5,57.5 TP23.TP 64.44,57.5 U9.23 U9.22
PWR_EN
  Top 0.2: U2.7 69.17,13.43 69,13.25 68,13.25 67.5,13.75 67.5,14.5 66.55,15.45 64.52,15.45 63.87,16.1 VR1.1
RTS  (via drill 0.35)
  Top 0.2: T1.4 31.61,45.55 R19.1 30.6,45.65 30,46.25 30,50.25 v32.5,52.75 | U5.24 37.75,56.75 37.5,57 v37.5,57.75
  Bottom 0.2: v32.5,52.75 v37.5,57.75
SHCP  (via drill 0.35)
  Top 0.2: U4.11 99.91,28.59 v98.5,30 | v19.5,37.75 19.5,34.58 U1.P$10
  Bottom 0.2: v98.5,30 75.25,30 73,32.25 49.75,32.25 44.5,37.5 21.75,37.5 21.5,37.75 v19.5,37.75
SLEEP_M1  (via drill 0.35)
  Top 0.2: U6.1 86.63,44.87 TP8.TP | U1.P$33 14.34,49.41 v14.5,49.25
  Bottom 0.2: v14.5,49.25 22.25,49.25 25.5,46 74.53,46 76.03,44.5 TP8.TP
SLEEP_M2  (via drill 0.35)
  Top 0.2: TP11.TP 123.63,44.87 U8.1 | v23.25,38.25 23.25,39 20.67,41.58 20.67,48.75 19.42,50 U1.P$29
  Bottom 0.2: TP11.TP 124,39 116,31 75.75,31 74,32.75 50,32.75 44.5,38.25 v23.25,38.25
SLEEP_M3  (via drill 0.35)
  Top 0.2: TP14.TP 105.13,44.87 U7.1 | v23.25,40.25 23.25,51.48 U1.P$26
  Bottom 0.2: TP14.TP 105.5,42 103.25,39.75 98,39.75 92.5,34.25 50.75,34.25 44.75,40.25 v23.25,40.25
SLEEP_SOLE  (via drill 0.35)
  Top 0.2: U9.9 60.75,62.25 61.5,63 v64,63 R31.2 | U1.P$16 25.55,38.5 27,38.5 28.5,40 v28.5,48
  Bottom 0.2: v28.5,48 48.75,48 61.37,60.62 61.37,62.26 62.11,63 v64,63
STATE_LED_B
  Top 0.2: U4.2 94.83,13.37 P1.P$9
STATE_LED_G  (via drill 0.35)
  Top 0.2: U4.1 93.56,14.95 v94.02,14.48
  Bottom 0.2: v94.02,14.48 96.25,14.48 P1.P$8
STATE_LED_R  (via drill 0.35)
  Top 0.2: v95.25,23.25 94.83,23.68 U4.15
  Bottom 0.2: P1.P$7 100.27,19.73 97,23 95.5,23 v95.25,23.25
STCP  (via drill 0.35)
  Top 0.2: U4.12 98.64,27.61 v97.25,29 | U1.P$11 20.69,36.94 v20.75,37
  Bottom 0.2: v97.25,29 75.25,29 72.5,31.75 49.5,31.75 44.25,37 v20.75,37
STEP_M1  (via drill 0.35)
  Top 0.2: U6.11 77.58,44.08 75.5,42 TP6.TP | U1.P$37 9.26,48.51 9.25,48.5 11.5,46.25 v11.5,46
  Bottom 0.2: v11.5,46 24,46 25,45 69.25,45 72.25,42 TP6.TP
STEP_M2  (via drill 0.35)
  Top 0.2: U8.11 114.58,44.08 112.5,42 TP9.TP | U1.P$31 16.88,49.87 19.34,47.41 19.34,41.66 v22,39
  Bottom 0.2: TP9.TP 107,42 103.75,38.75 98.5,38.75 93,33.25 50.25,33.25 44.5,39 v22,39
STEP_M3  (via drill 0.35)
  Top 0.2: TP12.TP 92,42.5 94.5,42.5 96.08,44.08 U7.11 | v21.5,42.25 21.44,42.31 21.44,49 20.69,49.75 U1.P$28
  Bottom 0.2: TP12.TP 90.15,40.65 90.12,40.65 84.22,34.75 51,34.75 44.75,41 22.75,41 v21.5,42.25
U0RX
  Top 0.2: U1.P$34 13.07,52.82 13.5,53.25 30,53.25 TP17.TP JP3.P$2
U0TX
  Top 0.2: U1.P$35 11.75,51.55 11.75,53 12.75,54 26,54 29.25,57.25 TP18.TP JP4.P$2
VBAT  (via drill 0.35, 0.5)
  Top 0.2: U3.3 74.55,16.6 R36.1 71.5,16.65 | 71.5,16.65 C3.1 69.83,15.97 U2.6 | 71.5,16.65 v71.5,15.25 | C6.1 59.6,17 v57.5,17 | TP28.TP 53.5,12.25 51.75,14 51.75,17.5 52.05,17.8 VR1.2
  Top 0.5: JP5.P$2 70.55,22 v72.5,22 72.55,22.05 JP11.P$2 | VR1.2 56.7,17.8 v57.5,17
  Bottom 0.2: v71.5,15.25 72.5,15.25
  Bottom 0.5: J1.1 72.5,6 | 72.5,6 68.5,6 v57.5,17 | 72.5,6 72.5,15.25 v72.5,22
VMOT  (via drill 0.5)
  Top 0.5: JP11.P$1 JP10.P$2 v76.5,31.75 76.4,31.75 C14.1 75.7,35.85 C16.1 C18.1 C20.1 80.17,36.02 U6.18 U6.19 | C28.1 112.7,35.85 C29.1 C31.1 C32.1 v117,37.5 117.17,37.67 U8.18 U8.19 | C15.1 94.2,35.85 C17.1 C19.1 C21.1 v98.5,37.5 98.67,37.67 U7.18 U7.19
  Bottom 0.5: v76.5,31.75 92.75,31.75 v98.5,37.5 v117,37.5
VUSB  (via drill 0.35)
  Top 0.2: U3.4 74.5,11.7 v74.5,10.5 C5.1 69.65,4.5 TP27.TP | U5.7 U5.8 45.6,54.75 C11.1 48.6,55.15 66.22,37.53 66.22,23.75 v66.47,23.5
  Bottom 0.2: v74.5,10.5 74.5,21.75 72.75,23.5 v66.47,23.5
  Bottom 0.3: P1.P$1 115.51,12.5 113.51,10.5 v74.5,10.5
~PWR_KILL  (via drill 0.35)
  Top 0.2: U2.2 69.17,10.75 | 69.17,10.75 69.17,10.03 R1.2 | TP5.TP 68.25,10.75 69.17,10.75 | U1.P$8 16.88,31.37 v18.5,29.75
  Bottom 0.2: v18.5,29.75 29.75,18.5 60.5,18.5 TP5.TP
~TURN_OFF  (via drill 0.35)
  Top 0.2: U2.8 68.5,14.21 R2.2 66.85,16.65 TP4.TP | v11.75,36.5 11.8,36.45 U1.P$4
  Bottom 0.2: TP4.TP 53.75,29.75 48.5,29.75 45.25,33 15,33 11.75,36.25 v11.75,36.5

### Text on the board
tStop: PuzzleController v1 / BA MagicTrick / ZHAW SoE, 2021 | TOP
bStop: BOT